# Altium schematic sheet Components_wheatherlab.SchDoc
size A2; SheetNumber: 2; SheetTotal: 2
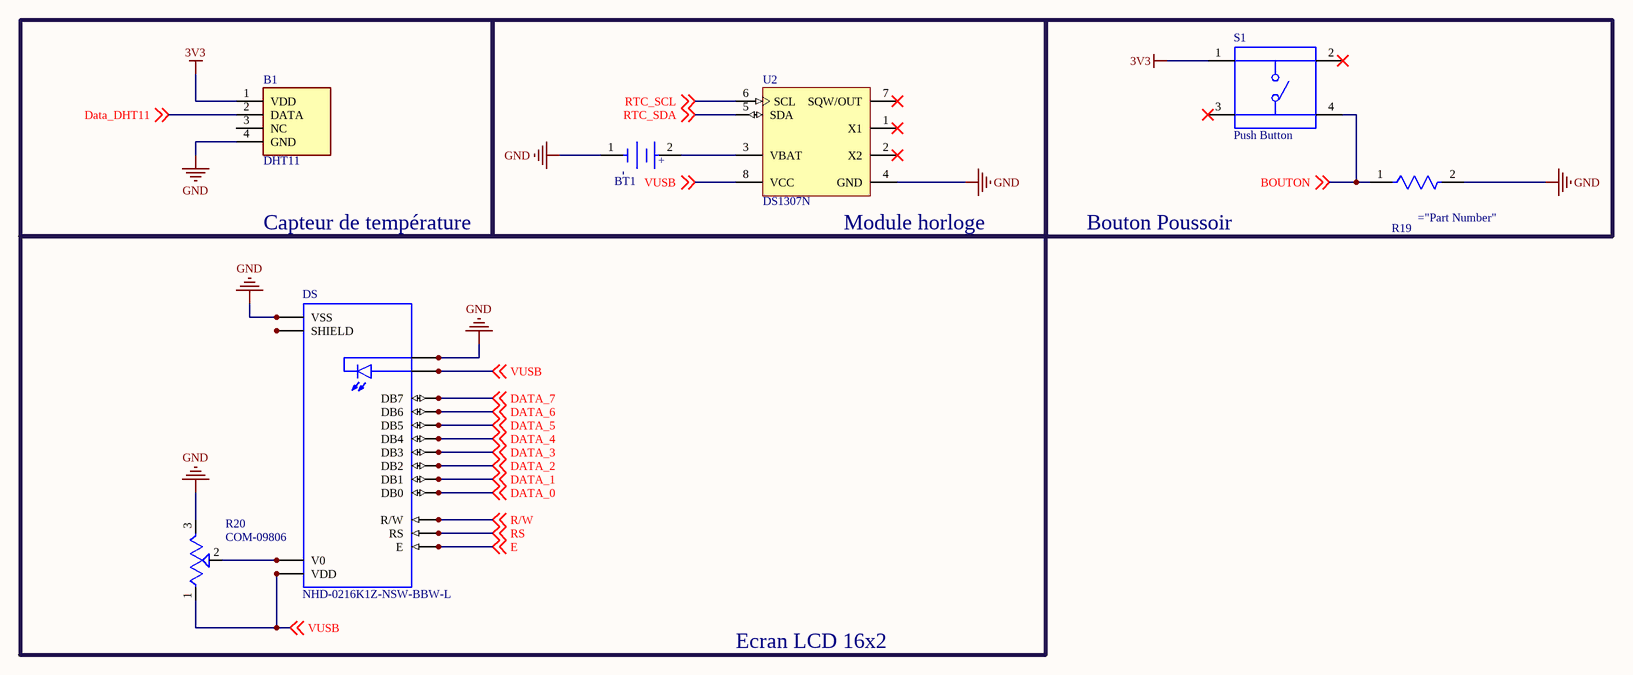
[diagram p0: Components_wheatherlab.SchDoc]

## Parts
B1  DHT11  [386]
BT1  3034TR  [Keystone_0_MFG]  (value not drawn)
DS  NHD-0216K1Z-NSW-BBW-L  [NHD_NHD-0216K1Z-NSW-BBW-L]
R19  10kohm  [Stackpole_RMCF0603_IPC_A]  (value not drawn)
R20  COM-09806  [TRIM_COM-09806]
S1  Push Button  [SW_TS02-66-50-BK-160-LCR-D]
U2  DS1307N  [P8-2]

## Blocks framed on the sheet
Capteur de température: B1
Module horloge: BT1 U2
Bouton Poussoir: R19 S1
Ecran LCD 16x2: DS R20

## Nets
3V3: B1.1(VDD) S1.1
GND: B1.4(GND) BT1.1(C) DS.1_1(VSS) DS.1_2(VSS) DS.16_1(LED-) DS.16_2(LED-) R19.2 R20.3(CW) U2.4(GND)
BOUTON: R19.1 S1.4 ; off-sheet BOUTON
DATA_0: DS.7_1(DB0) DS.7_2(DB0) ; off-sheet DATA_0
DATA_1: DS.8_1(DB1) DS.8_2(DB1) ; off-sheet DATA_1
DATA_2: DS.9_1(DB2) DS.9_2(DB2) ; off-sheet DATA_2
DATA_3: DS.10_1(DB3) DS.10_2(DB3) ; off-sheet DATA_3
DATA_4: DS.11_1(DB4) DS.11_2(DB4) ; off-sheet DATA_4
DATA_5: DS.12_1(DB5) DS.12_2(DB5) ; off-sheet DATA_5
DATA_6: DS.13_1(DB6) DS.13_2(DB6) ; off-sheet DATA_6
DATA_7: DS.14_1(DB7) DS.14_2(DB7) ; off-sheet DATA_7
Data_DHT11: B1.2(DATA) ; off-sheet Data_DHT11
E: DS.6_1(E) DS.6_2(E) ; off-sheet E
R/W: DS.5_1(R/W) DS.5_2(R/W) ; off-sheet R/W
RS: DS.4_1(RS) DS.4_2(RS) ; off-sheet RS
RTC_SCL: U2.6(SCL) ; off-sheet RTC_SCL
RTC_SDA: U2.5(SDA) ; off-sheet RTC_SDA
VUSB: DS.2_1(VDD) DS.2_2(VDD) DS.15_1(LED+) DS.15_2(LED+) R20.1(CCW) U2.8(VCC) ; off-sheet VUSB
NetBT1_2: BT1.2(A) U2.3(VBAT)
NetDS_3_1: DS.3_1(V0) DS.3_2(V0) R20.2(WIPER)
NetDS_S1: DS.S1(SHIELD) DS.S2(SHIELD) DS.S3(SHIELD) DS.S4(SHIELD)

Not connected (* = marked no-connect by the designer): B1 3(NC); S1 2* 3*; U2 1(X1)* 2(X2)* 7(SQW/OUT)*

## Notes on the sheet
- (in symbol 3034TR) +; -

## Library data of the parts
B1 = 386: Adafruit Accessories DHT11 Basic Temp Humidity Sensor; Geometry.Height: 15.5mm; Manufacturer_Name: Adafruit; Manufacturer_Part_Number: 386; Mouser Part Number: 485-386; Mouser Price/Stock: https://www.mouser.co.uk/ProductDetail/Adafruit/386?qs=GURawfaeGuDbeGFpZ2393w%3D%3D; Arrow Part Number: 386; Arrow Price/Stock: https://www.arrow.com/en/products/386/adafruit-industries?region=nac; Datasheet Link: https://datasheet.datasheetarchive.com/originals/distributors/DKDS-1/1982.pdf
DS = NHD-0216K1Z-NSW-BBW-L: Character LCD Display Module Transmissive 5 x 8 Dots STN - Super-Twisted Nematic LED - White Parallel 80.00mm x 36.00mm x 13.50mm; MF: Newhaven Display; Package: None; MP: NHD-0216K1Z-NSW-BBW-L; DigiKey-Purchase-URL: https://snapeda.com/shop?store=DigiKey&id=55814; Digi-Key_Part_Number: NHD-0216K1Z-NSW-BBW-L-ND; Value: *; SnapEDA_Link: https://www.snapeda.com/parts/NHD-0216K1Z-NSW-BBW-L/Newhaven%20Display%20Intl/view-part/55814/?ref=snap
R19 = RMCF0603FT220R
R20 = COM-09806: 10 kOhms 0.5W, 1/2W PC Pins Through Hole Trimmer Potentiometer Cermet 1 Turn Top Adjustment; Package: None; Price: None; Value: *; MP: COM-09806; Availability: Unavailable
S1 = TS02-66-50-BK-160-LCR-D: MF: {'manufacturer': u'CUI'}; Package: None; Availability: Unavailable; Value: *; MP: TS02-66-50-BK-160-LCR-D; Price: None
U2 = DS1307N: 64 x 8, Serial, I2C Real-Time Clock, 5.0V, 8-Pin PDIP, -40 to 85 degC; ComponentLink1Description: Manufacturer URL; ComponentLink2Description: Datasheet; DatasheetVersion: 10-Feb-2008; ComponentLink3URL: http://pdfserv.maxim-ic.com/package_dwgs/21-0043.PDF; ComponentLink3Description: Package Specification; ComponentLink1URL: http://www.maxim-ic.com; Code_JEDEC: MS-001-AB; PackageVersion: revE, 2011; PackageDescription: 8-Pin Plastic Dual-In-Line, Narrow (0.3in), Pitch 2.54 mm, PDIP(N); ComponentLink2URL: http://datasheets.maxim-ic.com/en/ds/DS1307.pdf; PackageReference: P8-2; PartNumber: DS1307N